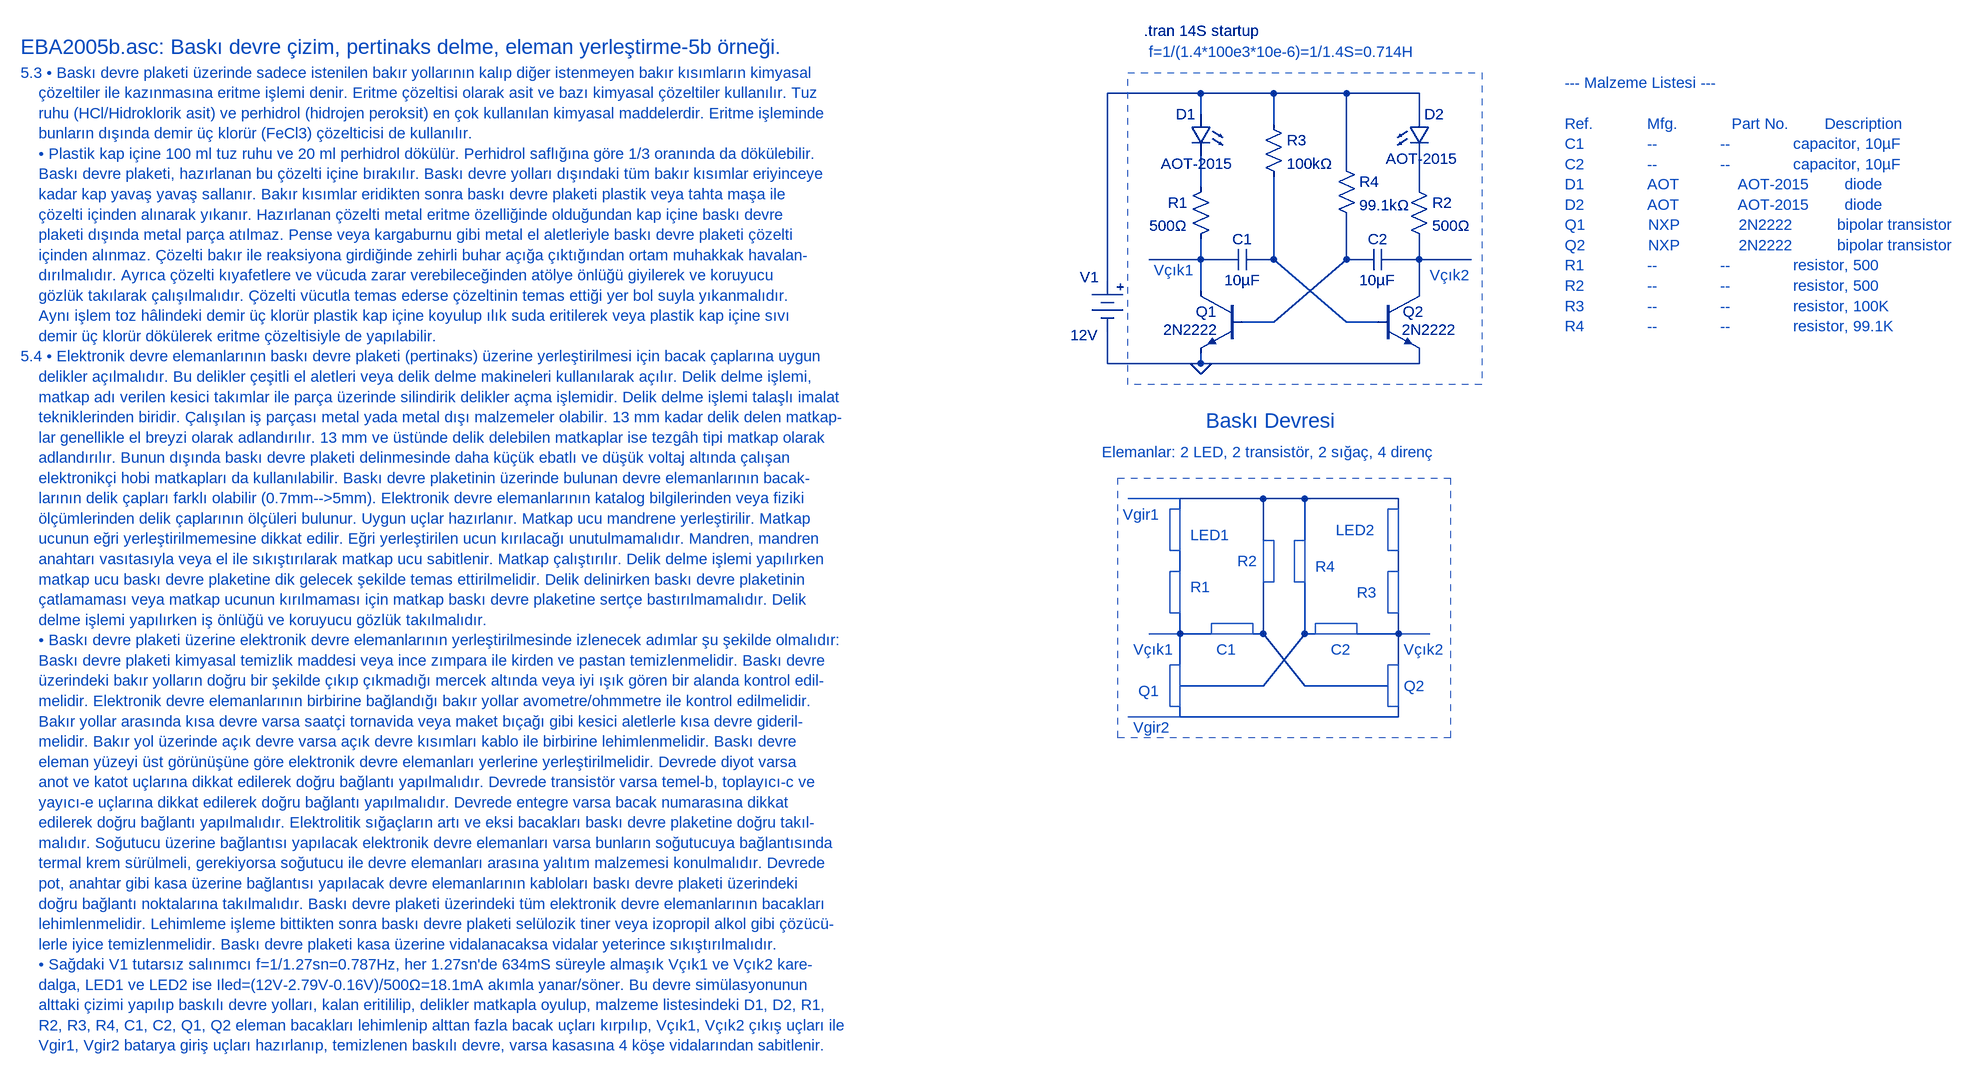
[diagram p0: schematic EBA2005b.asc]
EBA2005b.asc, the LTspice schematic file:
Version 4
SHEET 1 7064 4332
WIRE 1584 128 1440 128
WIRE 1696 128 1584 128
WIRE 1808 128 1696 128
WIRE 1920 128 1808 128
WIRE 1584 160 1584 128
WIRE 1920 160 1920 128
WIRE 1696 176 1696 128
WIRE 1808 240 1808 128
WIRE 1584 272 1584 224
WIRE 1920 272 1920 224
WIRE 1584 384 1584 352
WIRE 1584 384 1504 384
WIRE 1616 384 1584 384
WIRE 1696 384 1696 256
WIRE 1696 384 1680 384
WIRE 1808 384 1808 320
WIRE 1824 384 1808 384
WIRE 1920 384 1920 352
WIRE 1920 384 1888 384
WIRE 2000 384 1920 384
WIRE 1440 416 1440 128
WIRE 1584 432 1584 384
WIRE 1920 432 1920 384
WIRE 1696 480 1808 384
WIRE 1696 480 1648 480
WIRE 1808 480 1696 384
WIRE 1856 480 1808 480
WIRE 1440 544 1440 496
WIRE 1584 544 1584 528
WIRE 1584 544 1440 544
WIRE 1920 544 1920 528
WIRE 1920 544 1584 544
WIRE 1680 752 1552 752
WIRE 1744 752 1680 752
WIRE 1888 752 1744 752
WIRE 1552 768 1552 752
WIRE 1888 768 1888 752
WIRE 1680 816 1680 752
WIRE 1744 816 1744 752
WIRE 1552 864 1552 832
WIRE 1888 864 1888 832
WIRE 1552 960 1552 928
WIRE 1600 960 1552 960
WIRE 1680 960 1680 880
WIRE 1680 960 1664 960
WIRE 1744 960 1744 880
WIRE 1760 960 1744 960
WIRE 1888 960 1888 928
WIRE 1888 960 1824 960
WIRE 1552 1008 1552 960
WIRE 1888 1008 1888 960
WIRE 1680 1040 1744 960
WIRE 1680 1040 1552 1040
WIRE 1744 1040 1680 960
WIRE 1872 1040 1744 1040
WIRE 1552 1088 1552 1072
WIRE 1888 1088 1888 1072
WIRE 1888 1088 1552 1088
FLAG 1584 544 0
SYMBOL Misc\\battery 1440 400 M0
WINDOW 0 13 11 Left 2
WINDOW 3 14 100 Left 2
SYMATTR InstName V1
SYMATTR Value 12V
SYMBOL npn 1648 432 M0
WINDOW 0 39 32 Left 2
WINDOW 3 37 60 Left 2
SYMATTR InstName Q1
SYMATTR Value 2N2222
SYMBOL npn 1856 432 R0
WINDOW 0 39 32 Left 2
WINDOW 3 37 60 Left 2
SYMATTR InstName Q2
SYMATTR Value 2N2222
SYMBOL res 1600 256 M0
SYMATTR InstName R1
SYMATTR Value 500Ω
SYMBOL res 1904 256 R0
SYMATTR InstName R2
SYMATTR Value 500Ω
SYMBOL LED 1600 160 M0
WINDOW 3 -34 76 Left 2
SYMATTR Value AOT-2015
SYMATTR InstName D1
SYMATTR Description Diode
SYMATTR Type diode
SYMBOL LED 1904 160 R0
WINDOW 3 -35 69 Left 2
SYMATTR Value AOT-2015
SYMATTR InstName D2
SYMATTR Description Diode
SYMATTR Type diode
SYMBOL res 1680 160 R0
SYMATTR InstName R3
SYMATTR Value 100kΩ
SYMBOL res 1792 224 R0
SYMATTR InstName R4
SYMATTR Value 99.1kΩ
SYMBOL cap 1680 368 R90
WINDOW 0 0 32 VBottom 2
WINDOW 3 32 32 VTop 2
SYMATTR InstName C1
SYMATTR Value 10µF
SYMBOL cap 1888 368 R90
WINDOW 0 0 32 VBottom 2
WINDOW 3 32 32 VTop 2
SYMATTR InstName C2
SYMATTR Value 10µF
TEXT -232 56 Left 3 ;EBA2005b.asc: Baskı devre çizim, pertinaks delme, eleman yerleştirme-5b örneği.
TEXT -232 96 Left 2 ;5.3 • Baskı devre plaketi üzerinde sadece istenilen bakır yollarının kalıp diğer istenmeyen bakır kısımların kimyasal \n    çözeltiler ile kazınmasına eritme işlemi denir. Eritme çözeltisi olarak asit ve bazı kimyasal çözeltiler kullanılır. Tuz \n    ruhu (HCl/Hidroklorik asit) ve perhidrol (hidrojen peroksit) en çok kullanılan kimyasal maddelerdir. Eritme işleminde \n    bunların dışında demir üç klorür (FeCl3) çözelticisi de kullanılır.\n    • Plastik kap içine 100 ml tuz ruhu ve 20 ml perhidrol dökülür. Perhidrol saflığına göre 1/3 oranında da dökülebilir. \n    Baskı devre plaketi, hazırlanan bu çözelti içine bırakılır. Baskı devre yolları dışındaki tüm bakır kısımlar eriyinceye \n    kadar kap yavaş yavaş sallanır. Bakır kısımlar eridikten sonra baskı devre plaketi plastik veya tahta maşa ile \n    çözelti içinden alınarak yıkanır. Hazırlanan çözelti metal eritme özelliğinde olduğundan kap içine baskı devre \n    plaketi dışında metal parça atılmaz. Pense veya kargaburnu gibi metal el aletleriyle baskı devre plaketi çözelti \n    içinden alınmaz. Çözelti bakır ile reaksiyona girdiğinde zehirli buhar açığa çıktığından ortam muhakkak havalan-\n    dırılmalıdır. Ayrıca çözelti kıyafetlere ve vücuda zarar verebileceğinden atölye önlüğü giyilerek ve koruyucu \n    gözlük takılarak çalışılmalıdır. Çözelti vücutla temas ederse çözeltinin temas ettiği yer bol suyla yıkanmalıdır.\n    Aynı işlem toz hâlindeki demir üç klorür plastik kap içine koyulup ılık suda eritilerek veya plastik kap içine sıvı \n    demir üç klorür dökülerek eritme çözeltisiyle de yapılabilir.\n5.4 • Elektronik devre elemanlarının baskı devre plaketi (pertinaks) üzerine yerleştirilmesi için bacak çaplarına uygun \n    delikler açılmalıdır. Bu delikler çeşitli el aletleri veya delik delme makineleri kullanılarak açılır. Delik delme işlemi, \n    matkap adı verilen kesici takımlar ile parça üzerinde silindirik delikler açma işlemidir. Delik delme işlemi talaşlı imalat\n    tekniklerinden biridir. Çalışılan iş parçası metal yada metal dışı malzemeler olabilir. 13 mm kadar delik delen matkap-\n    lar genellikle el breyzi olarak adlandırılır. 13 mm ve üstünde delik delebilen matkaplar ise tezgâh tipi matkap olarak \n    adlandırılır. Bunun dışında baskı devre plaketi delinmesinde daha küçük ebatlı ve düşük voltaj altında çalışan \n    elektronikçi hobi matkapları da kullanılabilir. Baskı devre plaketinin üzerinde bulunan devre elemanlarının bacak-\n    larının delik çapları farklı olabilir (0.7mm-->5mm). Elektronik devre elemanlarının katalog bilgilerinden veya fiziki \n    ölçümlerinden delik çaplarının ölçüleri bulunur. Uygun uçlar hazırlanır. Matkap ucu mandrene yerleştirilir. Matkap \n    ucunun eğri yerleştirilmemesine dikkat edilir. Eğri yerleştirilen ucun kırılacağı unutulmamalıdır. Mandren, mandren\n    anahtarı vasıtasıyla veya el ile sıkıştırılarak matkap ucu sabitlenir. Matkap çalıştırılır. Delik delme işlemi yapılırken\n    matkap ucu baskı devre plaketine dik gelecek şekilde temas ettirilmelidir. Delik delinirken baskı devre plaketinin \n    çatlamaması veya matkap ucunun kırılmaması için matkap baskı devre plaketine sertçe bastırılmamalıdır. Delik \n    delme işlemi yapılırken iş önlüğü ve koruyucu gözlük takılmalıdır.\n    • Baskı devre plaketi üzerine elektronik devre elemanlarının yerleştirilmesinde izlenecek adımlar şu şekilde olmalıdır:\n    Baskı devre plaketi kimyasal temizlik maddesi veya ince zımpara ile kirden ve pastan temizlenmelidir. Baskı devre \n    üzerindeki bakır yolların doğru bir şekilde çıkıp çıkmadığı mercek altında veya iyi ışık gören bir alanda kontrol edil-\n    melidir. Elektronik devre elemanlarının birbirine bağlandığı bakır yollar avometre/ohmmetre ile kontrol edilmelidir.\n    Bakır yollar arasında kısa devre varsa saatçi tornavida veya maket bıçağı gibi kesici aletlerle kısa devre gideril-\n    melidir. Bakır yol üzerinde açık devre varsa açık devre kısımları kablo ile birbirine lehimlenmelidir. Baskı devre \n    eleman yüzeyi üst görünüşüne göre elektronik devre elemanları yerlerine yerleştirilmelidir. Devrede diyot varsa \n    anot ve katot uçlarına dikkat edilerek doğru bağlantı yapılmalıdır. Devrede transistör varsa temel-b, toplayıcı-c ve \n    yayıcı-e uçlarına dikkat edilerek doğru bağlantı yapılmalıdır. Devrede entegre varsa bacak numarasına dikkat \n    edilerek doğru bağlantı yapılmalıdır. Elektrolitik sığaçların artı ve eksi bacakları baskı devre plaketine doğru takıl-\n    malıdır. Soğutucu üzerine bağlantısı yapılacak elektronik devre elemanları varsa bunların soğutucuya bağlantısında \n    termal krem sürülmeli, gerekiyorsa soğutucu ile devre elemanları arasına yalıtım malzemesi konulmalıdır. Devrede \n    pot, anahtar gibi kasa üzerine bağlantısı yapılacak devre elemanlarının kabloları baskı devre plaketi üzerindeki \n    doğru bağlantı noktalarına takılmalıdır. Baskı devre plaketi üzerindeki tüm elektronik devre elemanlarının bacakları \n    lehimlenmelidir. Lehimleme işleme bittikten sonra baskı devre plaketi selülozik tiner veya izopropil alkol gibi çözücü-\n    lerle iyice temizlenmelidir. Baskı devre plaketi kasa üzerine vidalanacaksa vidalar yeterince sıkıştırılmalıdır.\n    • Sağdaki V1 tutarsız salınımcı f=1/1.27sn=0.787Hz, her 1.27sn'de 634mS süreyle almaşık Vçık1 ve Vçık2 kare-\n    dalga, LED1 ve LED2 ise Iled=(12V-2.79V-0.16V)/500Ω=18.1mA akımla yanar/söner. Bu devre simülasyonunun\n    alttaki çizimi yapılıp baskılı devre yolları, kalan eritililip, delikler matkapla oyulup, malzeme listesindeki D1, D2, R1, \n    R2, R3, R4, C1, C2, Q1, Q2 eleman bacakları lehimlenip alttan fazla bacak uçları kırpılıp, Vçık1, Vçık2 çıkış uçları ile\n    Vgir1, Vgir2 batarya giriş uçları hazırlanıp, temizlenen baskılı devre, varsa kasasına 4 köşe vidalarından sabitlenir.
TEXT 1496 32 Left 2 !.tran 14S startup
TEXT 1936 408 Left 2 ;Vçık2
TEXT 1512 400 Left 2 ;Vçık1
TEXT 1504 64 Left 2 ;f=1/(1.4*100e3*10e-6)=1/1.4S=0.714H
TEXT 1592 632 Left 3 ;Baskı Devresi
TEXT 1608 984 Left 2 ;C1
TEXT 1784 984 Left 2 ;C2
TEXT 1568 808 Left 2 ;LED1
TEXT 1792 800 Left 2 ;LED2
TEXT 1568 888 Left 2 ;R1
TEXT 1824 896 Left 2 ;R3
TEXT 1760 856 Left 2 ;R4
TEXT 1640 848 Left 2 ;R2
TEXT 1488 1048 Left 2 ;Q1
TEXT 1896 1040 Left 2 ;Q2
TEXT 1432 680 Left 2 ;Elemanlar: 2 LED, 2 transistör, 2 sığaç, 4 direnç
TEXT 2144 112 Left 2 ;--- Malzeme Listesi ---\n \nRef.            Mfg.            Part No.        Description\nC1              --              --              capacitor, 10µF\nC2              --              --              capacitor, 10µF\nD1              AOT             AOT-2015        diode\nD2              AOT             AOT-2015        diode\nQ1              NXP             2N2222          bipolar transistor\nQ2              NXP             2N2222          bipolar transistor\nR1              --              --              resistor, 500\nR2              --              --              resistor, 500\nR3              --              --              resistor, 100K\nR4              --              --              resistor, 99.1K
TEXT 1480 984 Left 2 ;Vçık1
TEXT 1896 984 Left 2 ;Vçık2
TEXT 1464 776 Left 2 ;Vgir1
TEXT 1480 1104 Left 2 ;Vgir2
LINE Normal 1936 960 1888 960
LINE Normal 1504 960 1552 960
LINE Normal 1472 752 1552 752
LINE Normal 1472 1088 1552 1088
RECTANGLE Normal 2016 576 1472 96 2
RECTANGLE Normal 1552 1072 1536 1008
RECTANGLE Normal 1664 944 1600 960
RECTANGLE Normal 1552 864 1536 928
RECTANGLE Normal 1552 768 1536 832
RECTANGLE Normal 1872 1072 1888 1008
RECTANGLE Normal 1760 944 1824 960
RECTANGLE Normal 1872 864 1888 928
RECTANGLE Normal 1872 768 1888 832
RECTANGLE Normal 1680 816 1696 880
RECTANGLE Normal 1728 816 1744 880
RECTANGLE Normal 1968 1120 1456 720 2

The netlist it stands for:
* EBA2005b.asc
V1 N001 0 12V
Q1 N004 N006 0 0 2N2222
Q2 N007 N005 0 0 2N2222
R1 N002 N004 500Ω
R2 N003 N007 500Ω
D1 N001 N002 AOT-2015
D2 N001 N003 AOT-2015
R3 N001 N005 100kΩ
R4 N001 N006 99.1kΩ
C1 N005 N004 10µF
C2 N007 N006 10µF
.model D D
.lib standard.dio
.model NPN NPN
.model PNP PNP
.lib standard.bjt
* EBA2005b.asc: Baskı devre çizim, pertinaks delme, eleman yerleştirme-5b örneği.
* 5.3 • Baskı devre plaketi üzerinde sadece istenilen bakır yollarının kalıp diğer istenmeyen bakır kısımların kimyasal
*     çözeltiler ile kazınmasına eritme işlemi denir. Eritme çözeltisi olarak asit ve bazı kimyasal çözeltiler kullanılır. Tuz
*     ruhu (HCl/Hidroklorik asit) ve perhidrol (hidrojen peroksit) en çok kullanılan kimyasal maddelerdir. Eritme işleminde
*     bunların dışında demir üç klorür (FeCl3) çözelticisi de kullanılır.
*     • Plastik kap içine 100 ml tuz ruhu ve 20 ml perhidrol dökülür. Perhidrol saflığına göre 1/3 oranında da dökülebilir.
*     Baskı devre plaketi, hazırlanan bu çözelti içine bırakılır. Baskı devre yolları dışındaki tüm bakır kısımlar eriyinceye
*     kadar kap yavaş yavaş sallanır. Bakır kısımlar eridikten sonra baskı devre plaketi plastik veya tahta maşa ile
*     çözelti içinden alınarak yıkanır. Hazırlanan çözelti metal eritme özelliğinde olduğundan kap içine baskı devre
*     plaketi dışında metal parça atılmaz. Pense veya kargaburnu gibi metal el aletleriyle baskı devre plaketi çözelti
*     içinden alınmaz. Çözelti bakır ile reaksiyona girdiğinde zehirli buhar açığa çıktığından ortam muhakkak havalan-
*     dırılmalıdır. Ayrıca çözelti kıyafetlere ve vücuda zarar verebileceğinden atölye önlüğü giyilerek ve koruyucu
*     gözlük takılarak çalışılmalıdır. Çözelti vücutla temas ederse çözeltinin temas ettiği yer bol suyla yıkanmalıdır.
*     Aynı işlem toz hâlindeki demir üç klorür plastik kap içine koyulup ılık suda eritilerek veya plastik kap içine sıvı
*     demir üç klorür dökülerek eritme çözeltisiyle de yapılabilir.
* 5.4 • Elektronik devre elemanlarının baskı devre plaketi (pertinaks) üzerine yerleştirilmesi için bacak çaplarına uygun
*     delikler açılmalıdır. Bu delikler çeşitli el aletleri veya delik delme makineleri kullanılarak açılır. Delik delme işlemi,
*     matkap adı verilen kesici takımlar ile parça üzerinde silindirik delikler açma işlemidir. Delik delme işlemi talaşlı imalat
*     tekniklerinden biridir. Çalışılan iş parçası metal yada metal dışı malzemeler olabilir. 13 mm kadar delik delen matkap-
*     lar genellikle el breyzi olarak adlandırılır. 13 mm ve üstünde delik delebilen matkaplar ise tezgâh tipi matkap olarak
*     adlandırılır. Bunun dışında baskı devre plaketi delinmesinde daha küçük ebatlı ve düşük voltaj altında çalışan
*     elektronikçi hobi matkapları da kullanılabilir. Baskı devre plaketinin üzerinde bulunan devre elemanlarının bacak-
*     larının delik çapları farklı olabilir (0.7mm-->5mm). Elektronik devre elemanlarının katalog bilgilerinden veya fiziki
*     ölçümlerinden delik çaplarının ölçüleri bulunur. Uygun uçlar hazırlanır. Matkap ucu mandrene yerleştirilir. Matkap
*     ucunun eğri yerleştirilmemesine dikkat edilir. Eğri yerleştirilen ucun kırılacağı unutulmamalıdır. Mandren, mandren
*     anahtarı vasıtasıyla veya el ile sıkıştırılarak matkap ucu sabitlenir. Matkap çalıştırılır. Delik delme işlemi yapılırken
*     matkap ucu baskı devre plaketine dik gelecek şekilde temas ettirilmelidir. Delik delinirken baskı devre plaketinin
*     çatlamaması veya matkap ucunun kırılmaması için matkap baskı devre plaketine sertçe bastırılmamalıdır. Delik
*     delme işlemi yapılırken iş önlüğü ve koruyucu gözlük takılmalıdır.
*     • Baskı devre plaketi üzerine elektronik devre elemanlarının yerleştirilmesinde izlenecek adımlar şu şekilde olmalıdır:
*     Baskı devre plaketi kimyasal temizlik maddesi veya ince zımpara ile kirden ve pastan temizlenmelidir. Baskı devre
*     üzerindeki bakır yolların doğru bir şekilde çıkıp çıkmadığı mercek altında veya iyi ışık gören bir alanda kontrol edil-
*     melidir. Elektronik devre elemanlarının birbirine bağlandığı bakır yollar avometre/ohmmetre ile kontrol edilmelidir.
*     Bakır yollar arasında kısa devre varsa saatçi tornavida veya maket bıçağı gibi kesici aletlerle kısa devre gideril-
*     melidir. Bakır yol üzerinde açık devre varsa açık devre kısımları kablo ile birbirine lehimlenmelidir. Baskı devre
*     eleman yüzeyi üst görünüşüne göre elektronik devre elemanları yerlerine yerleştirilmelidir. Devrede diyot varsa
*     anot ve katot uçlarına dikkat edilerek doğru bağlantı yapılmalıdır. Devrede transistör varsa temel-b, toplayıcı-c ve
*     yayıcı-e uçlarına dikkat edilerek doğru bağlantı yapılmalıdır. Devrede entegre varsa bacak numarasına dikkat
*     edilerek doğru bağlantı yapılmalıdır. Elektrolitik sığaçların artı ve eksi bacakları baskı devre plaketine doğru takıl-
*     malıdır. Soğutucu üzerine bağlantısı yapılacak elektronik devre elemanları varsa bunların soğutucuya bağlantısında
*     termal krem sürülmeli, gerekiyorsa soğutucu ile devre elemanları arasına yalıtım malzemesi konulmalıdır. Devrede
*     pot, anahtar gibi kasa üzerine bağlantısı yapılacak devre elemanlarının kabloları baskı devre plaketi üzerindeki
*     doğru bağlantı noktalarına takılmalıdır. Baskı devre plaketi üzerindeki tüm elektronik devre elemanlarının bacakları
*     lehimlenmelidir. Lehimleme işleme bittikten sonra baskı devre plaketi selülozik tiner veya izopropil alkol gibi çözücü-
*     lerle iyice temizlenmelidir. Baskı devre plaketi kasa üzerine vidalanacaksa vidalar yeterince sıkıştırılmalıdır.
*     • Sağdaki V1 tutarsız salınımcı f=1/1.27sn=0.787Hz, her 1.27sn'de 634mS süreyle almaşık Vçık1 ve Vçık2 kare-
*     dalga, LED1 ve LED2 ise Iled=(12V-2.79V-0.16V)/500Ω=18.1mA akımla yanar/söner. Bu devre simülasyonunun
*     alttaki çizimi yapılıp baskılı devre yolları, kalan eritililip, delikler matkapla oyulup, malzeme listesindeki D1, D2, R1,
*     R2, R3, R4, C1, C2, Q1, Q2 eleman bacakları lehimlenip alttan fazla bacak uçları kırpılıp, Vçık1, Vçık2 çıkış uçları ile
*     Vgir1, Vgir2 batarya giriş uçları hazırlanıp, temizlenen baskılı devre, varsa kasasına 4 köşe vidalarından sabitlenir.
.tran 14S startup
* Vçık2
* Vçık1
* f=1/(1.4*100e3*10e-6)=1/1.4S=0.714H
* Baskı Devresi
* C1
* C2
* LED1
* LED2
* R1
* R3
* R4
* R2
* Q1
* Q2
* Elemanlar: 2 LED, 2 transistör, 2 sığaç, 4 direnç
* --- Malzeme Listesi ---
* Ref.            Mfg.            Part No.        Description
* C1              --              --              capacitor, 10µF
* C2              --              --              capacitor, 10µF
* D1              AOT             AOT-2015        diode
* D2              AOT             AOT-2015        diode
* Q1              NXP             2N2222          bipolar transistor
* Q2              NXP             2N2222          bipolar transistor
* R1              --              --              resistor, 500
* R2              --              --              resistor, 500
* R3              --              --              resistor, 100K
* R4              --              --              resistor, 99.1K
* Vçık1
* Vçık2
* Vgir1
* Vgir2
.backanno
.end